# EAGLE design ECE477_schematic (EAGLE 8.6.0)
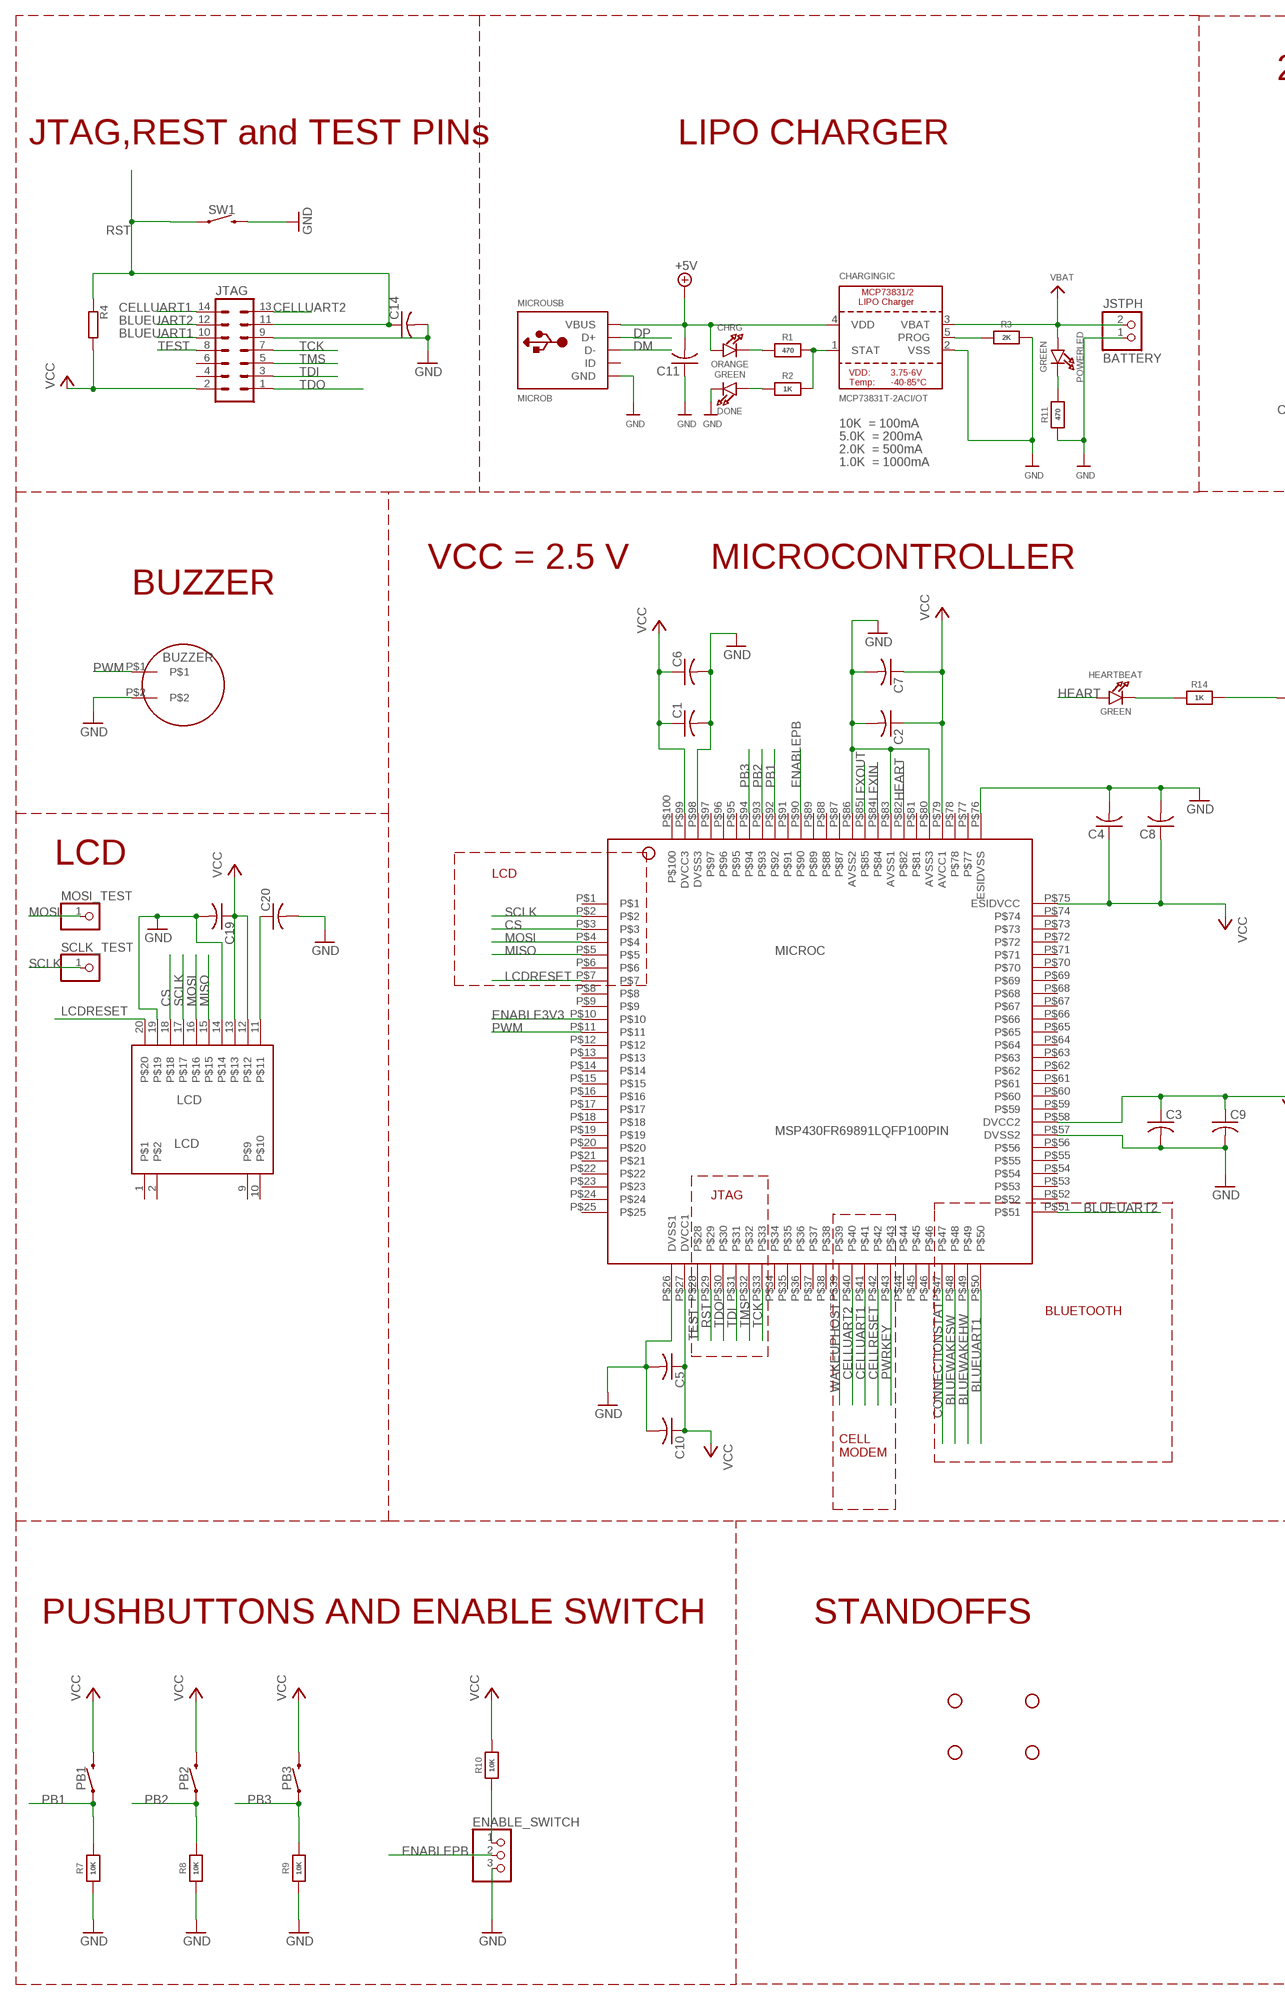
[diagram p0: schematic, sheet 1, part 1 of 2]
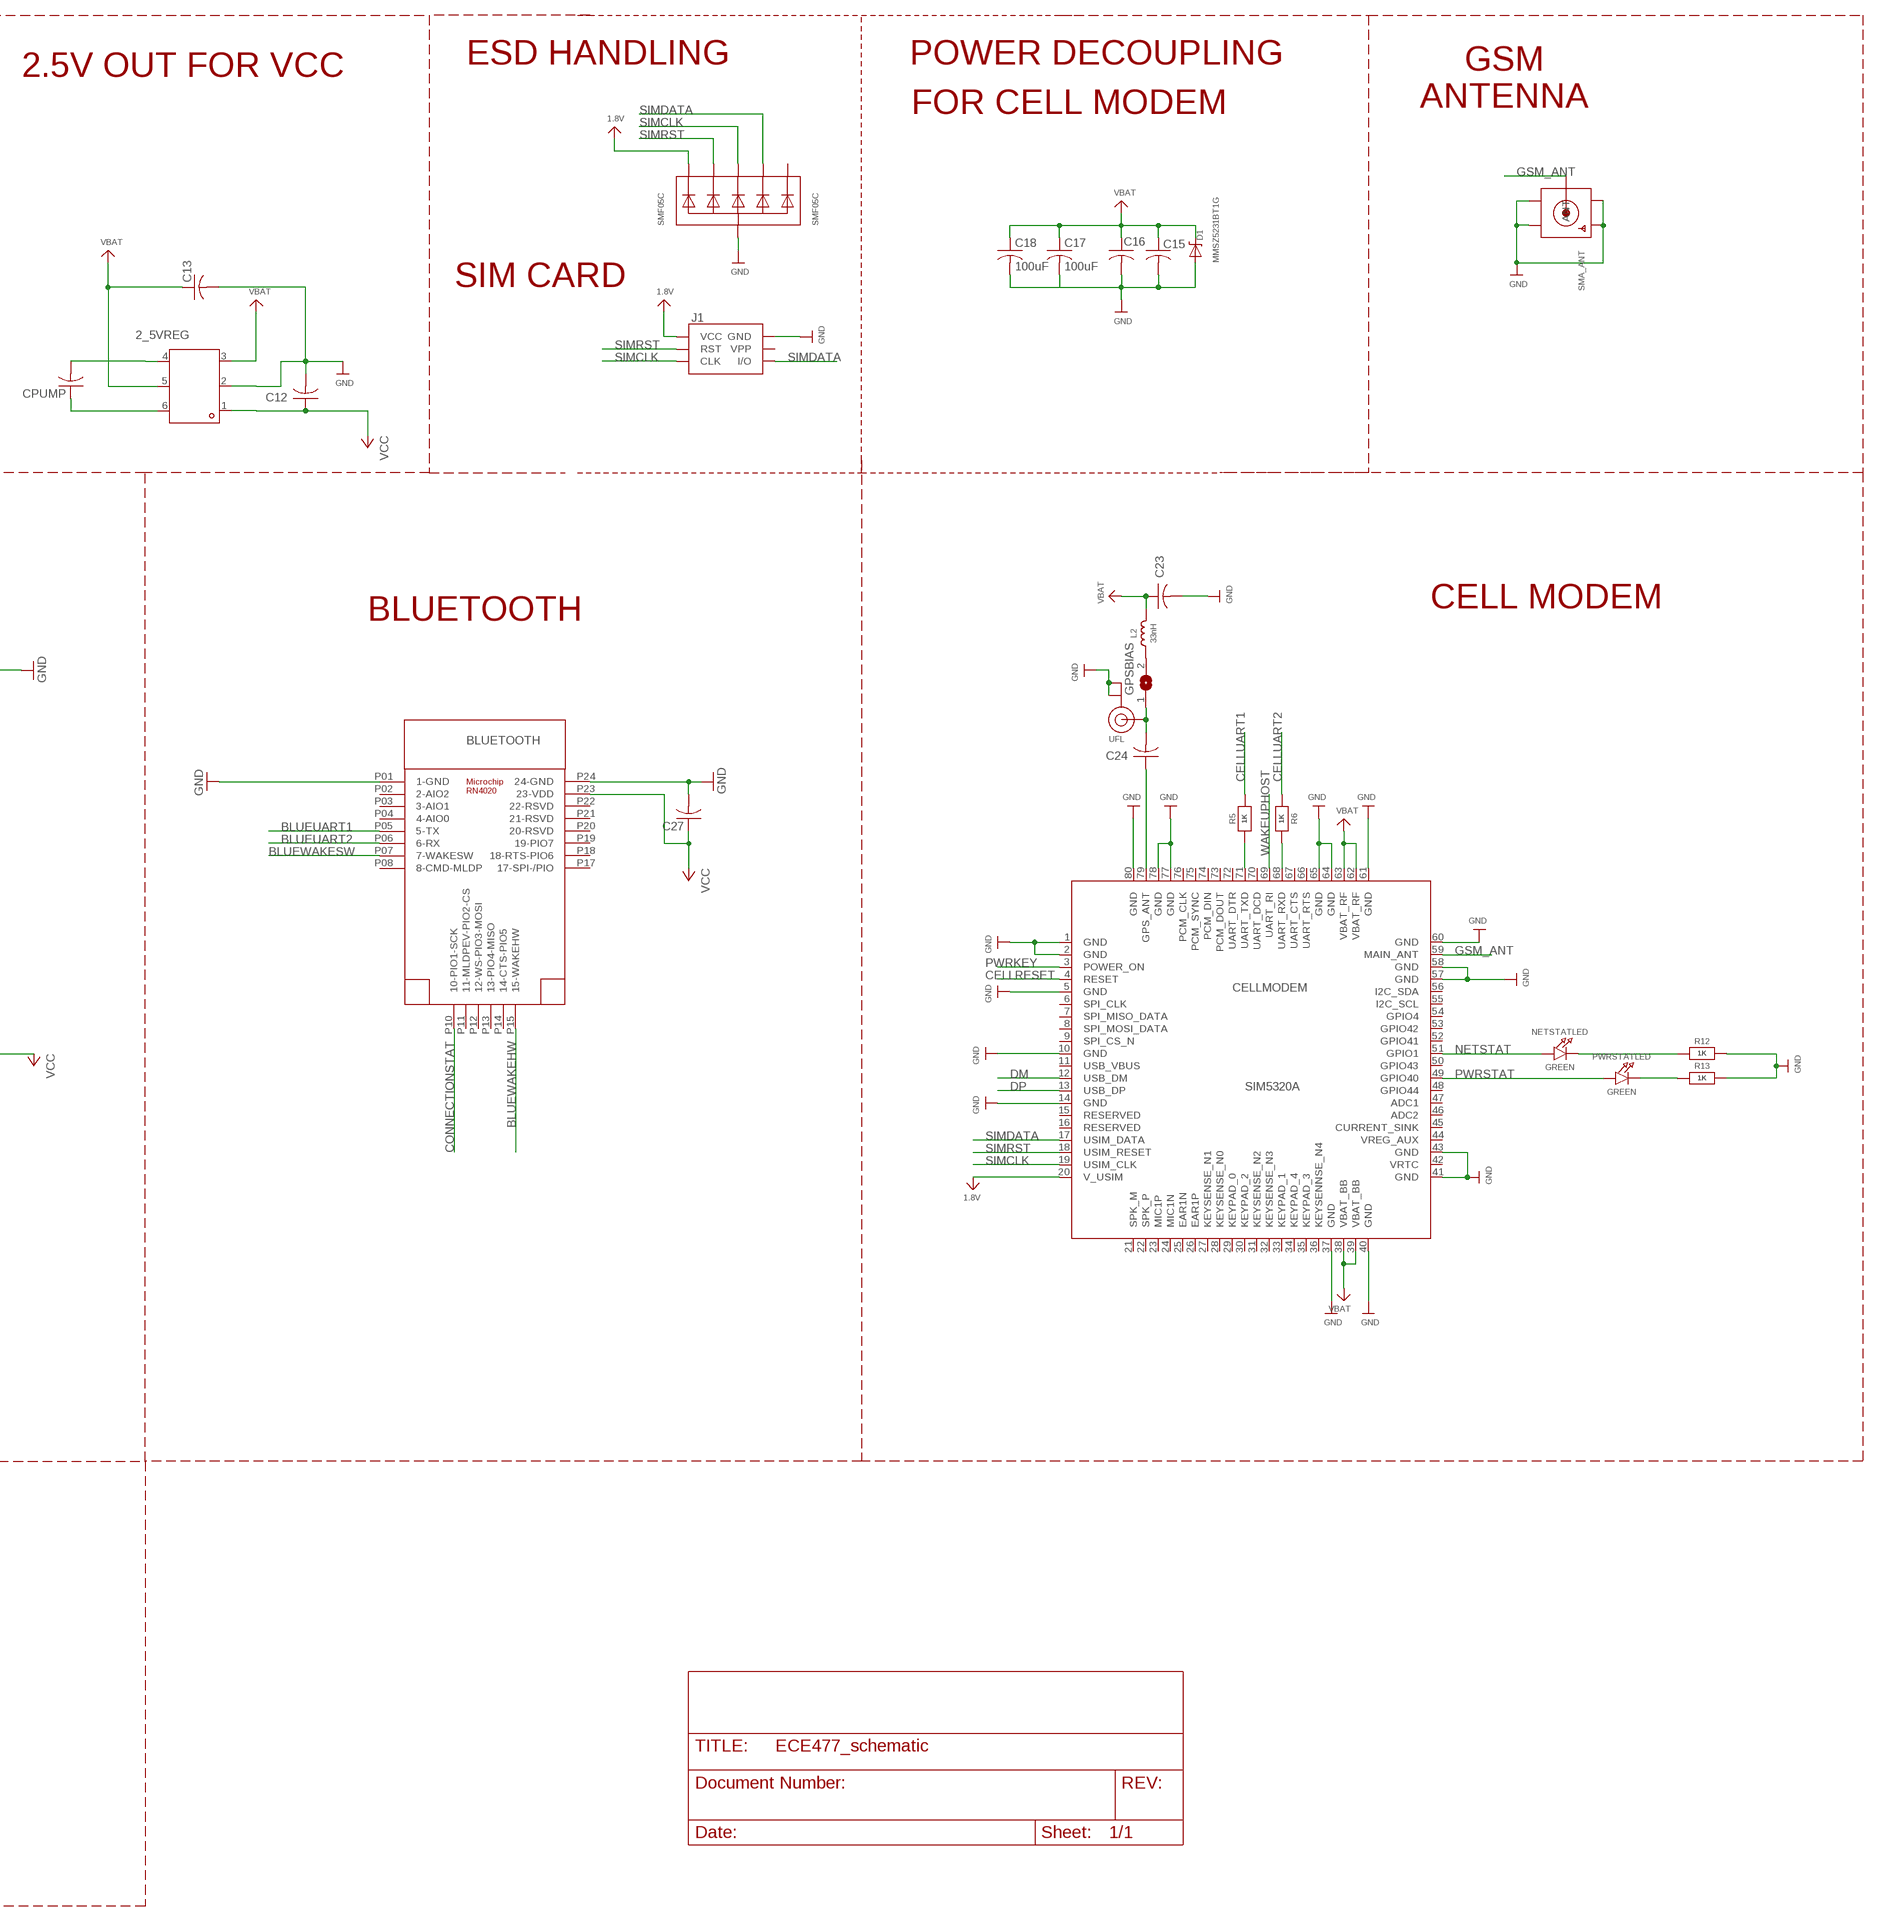
[diagram p1: schematic, sheet 1, part 2 of 2]

## Parts
2_5VREG  2_5VREG  [REG710NASOC6]
BATTERY  JSTPH  JST_2PIN  [JSTPH2]
BLUETOOTH  RN4020  [RN4020SMD]
BUZZER  BUZZER  [BUZZERTHROUGHHOLE]
C1  C-USC1206  [C1206]
C2  C-USC1206  [C1206]
C3  C-USC1206  [C1206]
C4  C-USC1206  [C1206]
C5  C-USC1206  [C1206]
C6  C-USC1206  [C1206]
C7  C-USC1206  [C1206]
C8  C-USC1206  [C1206]
C9  C-USC1206  [C1206]
C10  C-USC1206  [C1206]
C11  C-USC1206  [C1206]
C12  C-USC1206  [C1206]
C13  C-USC1206  [C1206]
C14  C-USC1206  [C1206]
C15  C-USC1206  [C1206]
C16  C-USC1206  [C1206]
C17  100uF  C-USC1210  [C1210]
C18  100uF  C-USC1210  [C1210]
C19  C-USC1206  [C1206]
C20  C-USC1206  [C1206]
C23  C-USC1206  [C1206]
C24  C-USC1206  [C1206]
C27  C-USC1206  [C1206]
CELLMODEM  SIM5320A  SIM5320  [MICROBUILDER_SIM5320]
CHARGINGIC  MCP73831T-2ACI/OT  MCP73831/2  [SOT23-5]
CHRG  ORANGE  LED0805_NOOUTLINE  [CHIPLED_0805_NOOUTLINE]
CPUMP  C-USC1206  [C1206]
D1  MMSZ5231BT1G  DIODE-ZENERSOD123  [SOD-123]
DONE  GREEN  LED0805_NOOUTLINE  [CHIPLED_0805_NOOUTLINE]
ENABLE_SWITCH  PINHD-1X3  [1X03]
GPSBIAS  SOLDERJUMPER  [SOLDERJUMPER_ARROW_NOPASTE]
H1  STAND-OFF  [STAND-OFF]
H2  STAND-OFF  [STAND-OFF]
H3  STAND-OFF  [STAND-OFF]
H4  STAND-OFF  [STAND-OFF]
HEARTBEAT  GREEN  LED0805_NOOUTLINE  [CHIPLED_0805_NOOUTLINE]
J1  SIMHOLDERSIM  [SIMHOLDER]
JTAG  CON-ML_ML14  [CON-ML_ML14]
L2  33nH  INDUCTOR_0805MP  [_0805MP]
LCD  LCD  [LCDTHROUGHHOLE]
MICROC  MSP430FR69891LQFP100PIN  [MSP430FR69891]
MICROUSB  MICROB  [ZX62DB5PA8(30)]
MOSI_TEST  PINHD-1X1  [1X01]
NETSTATLED  GREEN  LED0805_NOOUTLINE  [CHIPLED_0805_NOOUTLINE]
PB1  MOMENTARY-SWITCH-SPST-PTH-6.0MM  [TACTILE_SWITCH_PTH_6.0MM]
PB2  MOMENTARY-SWITCH-SPST-PTH-6.0MM  [TACTILE_SWITCH_PTH_6.0MM]
PB3  MOMENTARY-SWITCH-SPST-PTH-6.0MM  [TACTILE_SWITCH_PTH_6.0MM]
POWERLED  GREEN  LED0805_NOOUTLINE  [CHIPLED_0805_NOOUTLINE]
PWRSTATLED  GREEN  LED0805_NOOUTLINE  [CHIPLED_0805_NOOUTLINE]
R1  470  RESISTOR0805_NOOUTLINE  [0805-NO]
R2  1K  RESISTOR0805_NOOUTLINE  [0805-NO]
R3  2K  RESISTOR0805_NOOUTLINE  [0805-NO]
R4  SMD_R_0805  [SMD_0805]
R5  1K  RESISTOR0805_NOOUTLINE  [0805-NO]
R6  1K  RESISTOR0805_NOOUTLINE  [0805-NO]
R7  10K  RESISTOR0805_NOOUTLINE  [0805-NO]
R8  10K  RESISTOR0805_NOOUTLINE  [0805-NO]
R9  10K  RESISTOR0805_NOOUTLINE  [0805-NO]
R10  10K  RESISTOR0805_NOOUTLINE  [0805-NO]
R11  470  RESISTOR0805_NOOUTLINE  [0805-NO]
R12  1K  RESISTOR0805_NOOUTLINE  [0805-NO]
R13  1K  RESISTOR0805_NOOUTLINE  [0805-NO]
R14  1K  RESISTOR0805_NOOUTLINE  [0805-NO]
SCLK_TEST  PINHD-1X1  [1X01]
SMA_ANT  MICROBUILDER_SMACONNECTOR_EDGE  [MICROBUILDER_SMA_EDGELAUNCH]
SMF05C  SMF05C  TVSARRAY_5LANE  [SOT363]
SW1  MOMENTARY-SWITCH-SPST-PTH-6.0MM  [TACTILE_SWITCH_PTH_6.0MM]
UFL  MICROBUILDER_ANTENNA_U.FL  [MICROBUILDER_U.FL]

## Nets
1.8V: CELLMODEM.20(V_USIM) J1.C1(VCC) SMF05C.1(C1)
+5V: C11.2 CHARGINGIC.4(VDD) CHRG.A MICROUSB.+5V(VBUS)
BLUEUART1: BLUETOOTH.P05(5-TX) JTAG.10 MICROC.P$50
BLUEUART2: BLUETOOTH.P06(6-RX) JTAG.12 MICROC.P$51
BLUEWAKEHW: BLUETOOTH.P15(15-WAKEHW) MICROC.P$49
BLUEWAKESW: BLUETOOTH.P07(7-WAKESW) MICROC.P$48
CELLRESET: CELLMODEM.4(RESET) MICROC.P$42
CELLUART1: JTAG.14 MICROC.P$41 R5.2
CELLUART2: JTAG.13 MICROC.P$40 R6.2
CONNECTIONSTAT: BLUETOOTH.P10(10-PIO1-SCK) MICROC.P$47
CS: LCD.18 MICROC.P$3
DM: CELLMODEM.12(USB_DM) MICROUSB.D-
DP: CELLMODEM.13(USB_DP) MICROUSB.D+
ENABLE3V3: MICROC.P$10
ENABLEPB: ENABLE_SWITCH.2 MICROC.P$90
GND: 2_5VREG.2 BATTERY.1 BLUETOOTH.P01(1-GND) BLUETOOTH.P24(24-GND) BUZZER.P$2 C1.2 C2.2 C3.2 C4.2 C5.2 C6.2 C7.2 C8.2 C9.2 C10.2 C11.1 C12.2 C13.2 C14.2 C15.2 C16.2 C17.2 C18.2 C19.2 C20.2 C23.2 C27.2 CELLMODEM.1(GND) CELLMODEM.2(GND) CELLMODEM.5(GND) CELLMODEM.10(GND) CELLMODEM.14(GND) CELLMODEM.37(GND) CELLMODEM.40(GND) CELLMODEM.41(GND) CELLMODEM.43(GND) CELLMODEM.57(GND) CELLMODEM.58(GND) CELLMODEM.60(GND) CELLMODEM.61(GND) CELLMODEM.64(GND) CELLMODEM.65(GND) CELLMODEM.77(GND) CELLMODEM.78(GND) CELLMODEM.80(GND) CHARGINGIC.2(VSS) D1.A DONE.C ENABLE_SWITCH.3 J1.C5(GND) JTAG.9 LCD.14 LCD.19 MICROC.P$26(DVSS1) MICROC.P$57(DVSS2) MICROC.P$76(ESIDVSS) MICROC.P$80(AVSS3) MICROC.P$83(AVSS1) MICROC.P$86(AVSS2) MICROC.P$98(DVSS3) MICROUSB.GND R3.2 R7.1 R8.1 R9.1 R11.1 R12.2 R13.2 R14.2 SMA_ANT.GND@1(GND4) SMA_ANT.GND@2(GND3) SMA_ANT.GND@3(GND2) SMA_ANT.GND@4(GND1) SMF05C.2(A) SW1.3 UFL.1(GND) UFL.2(GND)
GSM_ANT: CELLMODEM.59(MAIN_ANT) SMA_ANT.P(ANT)
HEART: HEARTBEAT.A MICROC.P$82
LCDRESET: LCD.20 MICROC.P$7
LFXIN: MICROC.P$84
LFXOUT: MICROC.P$85
MISO: LCD.15 MICROC.P$5
MOSI: LCD.16 MICROC.P$4 MOSI_TEST.1
N$1: CHRG.C R1.1
N$2: CHARGINGIC.1(STAT) R1.2 R2.2
N$3: C20.1 LCD.11
N$4: 2_5VREG.4 CPUMP.2
N$5: CHARGINGIC.5(PROG) R3.1
N$6: DONE.A R2.1
N$7: 2_5VREG.6 CPUMP.1
N$8: C24.1 CELLMODEM.79(GPS_ANT)
N$9: C24.2 GPSBIAS.1 UFL.3(SIGNAL)
N$10: CELLMODEM.71(UART_TXD) R5.1
N$11: CELLMODEM.68(UART_RXD) R6.1
N$12: POWERLED.C R11.2
N$13: NETSTATLED.C R12.1
N$14: ENABLE_SWITCH.1 R10.1
N$15: PWRSTATLED.C R13.1
N$31: GPSBIAS.2 L2.1
N$84: HEARTBEAT.C R14.1
NETSTAT: CELLMODEM.51(GPIO1) NETSTATLED.A
PB1: MICROC.P$92 PB1.1 R7.2
PB2: MICROC.P$93 PB2.1 R8.2
PB3: MICROC.P$94 PB3.1 R9.2
PWM: BUZZER.P$1 MICROC.P$11
PWRKEY: CELLMODEM.3(POWER_ON) MICROC.P$43
PWRSTAT: CELLMODEM.49(GPIO40) PWRSTATLED.A
RST: C14.1 JTAG.11 MICROC.P$29 R4.1 SW1.1
SCLK: LCD.17 MICROC.P$2 SCLK_TEST.1
SIMCLK: CELLMODEM.19(USIM_CLK) J1.C3(CLK) SMF05C.4(C3)
SIMDATA: CELLMODEM.17(USIM_DATA) J1.C7(I/O) SMF05C.5(C4)
SIMRST: CELLMODEM.18(USIM_RESET) J1.C2(RST) SMF05C.3(C2)
TCK: JTAG.7 MICROC.P$33
TDI: JTAG.3 MICROC.P$31
TDO: JTAG.1 MICROC.P$30
TEST: JTAG.8 MICROC.P$28
TMS: JTAG.5 MICROC.P$32
VBAT: 2_5VREG.3 2_5VREG.5 BATTERY.2 C13.1 C15.1 C16.1 C17.1 C18.1 C23.1 CELLMODEM.38(VBAT_BB) CELLMODEM.39(VBAT_BB) CELLMODEM.62(VBAT_RF) CELLMODEM.63(VBAT_RF) CHARGINGIC.3(VBAT) D1.C L2.2 POWERLED.A
VCC: 2_5VREG.1 BLUETOOTH.P23(23-VDD) C1.1 C2.1 C3.1 C4.1 C5.1 C6.1 C7.1 C8.1 C9.1 C10.1 C12.1 C19.1 C27.1 JTAG.2 LCD.12 LCD.13 MICROC.P$27(DVCC1) MICROC.P$58(DVCC2) MICROC.P$75(ESIDVCC) MICROC.P$79(AVCC1) MICROC.P$99(DVCC3) PB1.3 PB2.3 PB3.3 R4.2 R10.2
WAKEUPHOST: CELLMODEM.69(UART_RI) MICROC.P$39
Unconnected: BLUETOOTH.P02(2-AIO2) BLUETOOTH.P03(3-AIO1) BLUETOOTH.P04(4-AIO0) BLUETOOTH.P08(8-CMD-MLDP) BLUETOOTH.P11(11-MLDPEV-PIO2-CS) BLUETOOTH.P12(12-WS-PIO3-MOSI) BLUETOOTH.P13(13-PIO4-MISO) BLUETOOTH.P14(14-CTS-PIO5) BLUETOOTH.P17(17-SPI-/PIO) BLUETOOTH.P18(18-RTS-PIO6) BLUETOOTH.P19(19-PIO7) BLUETOOTH.P20(20-RSVD) BLUETOOTH.P21(21-RSVD) BLUETOOTH.P22(22-RSVD) CELLMODEM.6(SPI_CLK) CELLMODEM.7(SPI_MISO_DATA) CELLMODEM.8(SPI_MOSI_DATA) CELLMODEM.9(SPI_CS_N) CELLMODEM.11(USB_VBUS) CELLMODEM.15(RESERVED) CELLMODEM.16(RESERVED) CELLMODEM.21(SPK_M) CELLMODEM.22(SPK_P) CELLMODEM.23(MIC1P) CELLMODEM.24(MIC1N) CELLMODEM.25(EAR1N) CELLMODEM.26(EAR1P) CELLMODEM.27(KEYSENSE_N1) CELLMODEM.28(KEYSENSE_N0) CELLMODEM.29(KEYPAD_0) CELLMODEM.30(KEYPAD_2) CELLMODEM.31(KEYSENSE_N2) CELLMODEM.32(KEYSENSE_N3) CELLMODEM.33(KEYPAD_1) CELLMODEM.34(KEYPAD_4) CELLMODEM.35(KEYPAD_3) CELLMODEM.36(KEYSENNSE_N4) CELLMODEM.42(VRTC) CELLMODEM.44(VREG_AUX) CELLMODEM.45(CURRENT_SINK) CELLMODEM.46(ADC2) CELLMODEM.47(ADC1) CELLMODEM.48(GPIO44) CELLMODEM.50(GPIO43) CELLMODEM.52(GPIO41) CELLMODEM.53(GPIO42) CELLMODEM.54(GPIO4) CELLMODEM.55(I2C_SCL) CELLMODEM.56(I2C_SDA) CELLMODEM.66(UART_RTS) CELLMODEM.67(UART_CTS) CELLMODEM.70(UART_DCD) CELLMODEM.72(UART_DTR) CELLMODEM.73(PCM_DOUT) CELLMODEM.74(PCM_DIN) CELLMODEM.75(PCM_SYNC) CELLMODEM.76(PCM_CLK) J1.C6(VPP) JTAG.4 JTAG.6 LCD.1 LCD.2 LCD.9 LCD.10 MICROC.P$1 MICROC.P$6 MICROC.P$8 MICROC.P$9 MICROC.P$12 MICROC.P$13 MICROC.P$14 MICROC.P$15 MICROC.P$16 MICROC.P$17 MICROC.P$18 MICROC.P$19 MICROC.P$20 MICROC.P$21 MICROC.P$22 MICROC.P$23 MICROC.P$24 MICROC.P$25 MICROC.P$34 MICROC.P$35 MICROC.P$36 MICROC.P$37 MICROC.P$38 MICROC.P$44 MICROC.P$45 MICROC.P$46 MICROC.P$52 MICROC.P$53 MICROC.P$54 MICROC.P$55 MICROC.P$56 MICROC.P$59 MICROC.P$60 MICROC.P$61 MICROC.P$62 MICROC.P$63 MICROC.P$64 MICROC.P$65 MICROC.P$66 MICROC.P$67 MICROC.P$68 MICROC.P$69 MICROC.P$70 MICROC.P$71 MICROC.P$72 MICROC.P$73 MICROC.P$74 MICROC.P$77 MICROC.P$78 MICROC.P$81 MICROC.P$87 MICROC.P$88 MICROC.P$89 MICROC.P$91 MICROC.P$95 MICROC.P$96 MICROC.P$97 MICROC.P$100 MICROUSB.ID SMF05C.6(C5)

## Notes on the sheet
- POWER DECOUPLING
- ESD HANDLING
- 2.5V OUT FOR VCC
- GSM
  ANTENNA
- FOR CELL MODEM
- LIPO CHARGER
- JTAG,REST and TEST PINs
- SIM CARD
- 10K  = 100mA
- 5.0K  = 200mA
- 2.0K  = 500mA
- 1.0K  = 1000mA
- VCC = 2.5 V | MICROCONTROLLER
- BUZZER
- CELL MODEM
- BLUETOOTH
- LCD
- LCD
- JTAG
- BLUETOOTH
- CELL
  MODEM
- PUSHBUTTONS AND ENABLE SWITCH | STANDOFFS

## Library data of the parts
2_5VREG = ECE477_parts_library:2_5VREG
BATTERY = microbuilder:JST_2PIN: JST 2-Pin Right-Angle Connector PH-Series - 4UConnector: 17311 SH-Series - 4UConnector: 07278
BLUETOOTH = microchip_bluetooth_v101:RN4020
BUZZER = ECE477_parts_library:BUZZER
C1-C16 C19 C20 C23 C24 C27 CPUMP = rcl:C-US: CAPACITOR, American symbol; SPICEPREFIX: C
C17 C18 = rcl:C-US: CAPACITOR, American symbol
CELLMODEM = ECE477_parts_library:SIM5320
CHARGINGIC = microbuilder:MCP73831/2: MCP73831/2 LIPO Charger VDD: 3.75 - 6V Temp -40 - 85°C Programmable Charge Rate: 15-500mA NOTE: STAT is a tri-state logic output on the MCP73831 and an open-drain output on the MCP73832. SOT23-5 with 4.2V output and tri-state logic on STAT = MCP73831T-2ACI/OT
CHRG DONE HEARTBEAT NETSTATLED POWERLED PWRSTATLED = microbuilder:LED: LED 0603 - 0603 Surface Mount Package 2mA: Green LED - Low Power (3.9mcd, 2ma, 1.7Vf) - Digikey: 475-2709-2-ND Orange LED - Low Power (9.8mcd, 2ma, 1.8Vf) - Digikey: 475-1194-2-ND Red LED - Low Power (5mcd, 2ma, 1.8Vf) - Digikey: 475-1195-2-ND Yellow LED - Low Power (7mcd, 2ma, 1.8Vf) - Digikey: 475-1196-2-ND 5mA: Blue LED - Low Power (17mcd, 5ma, 2.9Vf) - Digikey: LNJ937W8CRACT-ND 0805 - 0805 Surface Mount Package 2mA: Red LED (8.8mcd, 2mA, 1.8Vf, Clear) - Low Power [Digikey: 475-2510-1-ND] Green LED (5mcd, 2mA, 1.8Vf, Clear) - Low Power [Digikey: 475-2730-1-ND] Yellow LED (11.3mcd, 2mA, 1.8Vf, Clear) - Low Power [Digikey: 475-2555-1-ND] 20mA: Red LED (104mcd, 20mA, Diffused) - LS R976 [Digikey: 475-1278-6-ND] Red LED (12mcd, 20mA, 2.0Vf, Clear) - APT2012EC [Digikey: 754-1128-1-ND] Green LED (15mcd, 20mA, 2.2Vf, Clear) - APT2012GC [Digikey: 754-1131-1-ND] Orange LED (160mcd, 20mA, 2.1Vf, Clear) - APT2012SECK [Digikey: 754-1130-1-ND] 1206 - 1206 Surface Mount Package Green LED (26mcd, 20mA, Diffused) - LG N971 [Digikey: 475-1407-6-ND] Red LED (15mcd, 20mA, Diffused) - LH N974 [Digikey: 475-1416-6-ND] Cree - Cree High-Power Surface Mount LEDs XPEBWT-L1-0000-00D50 - White 111lm 350mA 2.9Vf 6200K 110° XTEAWT-00-0000-00000LEE3 - White 114lm 350mA 2.85Vf 5000K 115° Everlight - Everlight 45-21 Series Surface Mount LEDs 45-21/QK2C-B2832AC2CB2/2T - Warm White 2000mcd 20mA 3.25Vf 3050K 120° 45-21/LK2C-B38452C4CB2/2T - Nuetral White 2000mcd 20mA 3.25Vf 4150K 120° 45-21/LK2C-B50634C6CB2/2T - Cold White 2200mcd 20mA 3.25Vf 5650K 120° PLCC2 Reverse Mount LS T77K-J1L2-1-0-2-R18-Z - Red 11.25mcd 2mA 1.8Vf 630nm 120° LO T77K-L1M2-24-Z - Orange 19.6mcd 2mA 1.8Vf 606nm 120° LY T77K-K2M1-26-Z - Yellow 15.7mcd 2mA 1.8Vf 587nm 120°
D1 = microbuilder:DIODE-ZENER: Zener Diode SMA: 30V 1W Zener Diode, 1.2Vf - Digikey: SMAZ30-FDICT-ND
ENABLE_SWITCH = pinhead:PINHD-1X3: PIN HEADER
GPSBIAS = microbuilder:SOLDERJUMPER: SMD Solder JUMPER Solder the two pads together to create a connection, or remove the solder to break it. REFLOW - Use this footprint for solder paste and reflow ovens. WAVE - Use this footprint for hand-soldering (larger pads). CLOSED - Has a trace between the two pads to ensure it is closed by default. The trace needs to be cut to disable the jumper, and can be closed again by creating a solder bridge between the two pads.; BOM: EXCLUDE
H1-H4 = SparkFun-Hardware:STAND-OFF: Stand Off Drill holes for mechanically mounting via screws, standoffs, etc. Note: Use the keepout ring to avoid running the screw head into surrounding components. Variant Overviews STAND-OFF - Mechanical footprint for a #4 phillips button head screw. STAND-OFF-TIGHT - Mechanical footprint for a #4 phillips button head screw, Example SparkFun Products Screw - Phillips Head (1/4", 4-40, 10 pack) <https://www.sparkfun.com/products/10453> (PRT-10453) Screw - Phillips Head (1/2", 4-40, 10 pack) <https://www.sparkfun.com/products/10452> (PRT-10452) Screw - Phillips Head (3/4", 4-40, 10 pack) <https://www.sparkfun.com/products/10451> (PRT-10451) Screw - Phillips Head (1", 4-40, 10 pack) <https://www.sparkfun.com/products/10450> (PRT-10450)
J1 = SparkFun-Connectors:SIMHOLDER: SIM Cellular Card Socket SMT 6 pin standard connection. SparkFun Products: SIM Socket <https://www.sparkfun.com/products/548> SparkFun Cellular Shield - MG2639 <https://www.sparkfun.com/products/13120> SparkFun SIM Card Socket Breakout <https://www.sparkfun.com/products/573>; PROD_ID: CONN-08536; SF_ID: PRT-00548
JTAG = MSP-TS430PZ100D_v1.2:CON-ML_ML14: HARTING
L2 = microbuilder:INDUCTOR: Inductors 0603: 10nH Ceramic Inductor - microwire antenna/RF (Digikey: 712-1434-2-ND) 0805: 560nH Ceramic Inductor - RF (Digikey: 553-1047-1-ND) 270nH Ceramic Inductor - Q = 40@250MHz, +-5%, 1 Ohm DC Resistance (Digikey: 535-10506-2-ND) 1007 (2518 Metric) SMT: 10µH 10% 250mOhm 820mA 1007 Inductor (Digikey: 587-2189-1-ND) 22µH 10% 500mOhm 580mA 1007 Inductor (Digikey: 587-2190-1-ND) 47µH 10% 950mOhm 420mA 1007 Inductor (Digikey: 587-2191-1-ND) 47µH 5% 100mOhm 1A 1008 Inductor (Digikey: 732-1816-1-ND) 5.0x5.0mm (Taiyo Yuden NR5040 Series) 6.8µH 20% 2.3A 64mOhm Inductor (Digikey: 587-2374-2-ND) 5.0x5.0mm (TDK VLC5045 Series) 4.7µH 20% 3.3A 34mOhm Inductor (Digikey: 445-6526-1-ND) 6.8µH 20% 2.7A 46mOhm Inductor (Digikey: 445-6527-1-ND) 6.0x6.0mm (TDK VLC6045 Series) 4.7µH 20% 3.8A 27mOhm Inductor (Digikey: 445-6538-2-ND) 6.8µH 20% 3A 41mOhm Inductor (Digikey: 445-6540-1-ND) 6.2µH 30% 2.2A 45mOhm Inductor (Digikey: SRR5028-6R2YCT-ND) - Not TDK VLC6045 but footprint should match 6.0x6.0mm (TDK SLF6045 Series) 6.8uH 30% 2A 33mOhm Inductor (Digikey: 445-4572-1-ND, Mouser: 810-SLF645T6R8N2R0PF) 6.0x6.0mm (Sumida CDRH5D28 Series) 6.2uH 30% 1.8A 45mOhm Inductor (Digikey: 308-1542-1-ND) Taiyo Yuden NR3015T2R2M - 2.2uH 20% 1.5A (Digikey: 587-1648-2-ND, Mouser: 963-NR3015T2R2M) - Used with TI TPS62172 CoilCraft RFID Transponder Coil - MA5532-AE (For use with AS3935 Lightning Sensor) Vishay IHLP 1.0uH Molded Inductor - 24mOhm DCR, 5A, +/-20%, -55°C-125°C (Digikey: 541-1319-1-ND)
LCD = ECE477_parts_library:LCD
MICROC = ECE477_parts_library:MSP430FR69891
MICROUSB = ECE477_parts_library:MICROB
MOSI_TEST SCLK_TEST = pinhead:PINHD-1X1: PIN HEADER
PB1-PB3 SW1 = SparkFun-Switches:MOMENTARY-SWITCH-SPST: Momentary Switch (Pushbutton) - SPST Normally-open (NO) SPST momentary switches (buttons, pushbuttons). Variants PTH-12MM - 12mm square, through-hole Momentary Pushbutton Switch - 12mm Square <https://www.sparkfun.com/products/9190> (COM-09190) PTH-6.0MM, PTH-6.0MM-KIT - 6.0mm square, through-hole Mini Pushbutton Switch <https://www.sparkfun.com/products/97> (COM-00097) KIT package intended for soldering kit's - only one side of pads' copper is exposed. PTH-RIGHT-ANGLE-KIT - Right-angle, through-hole Right Angle Tactile Button <https://www.sparkfun.com/products/10791> - Used on SparkFun BigTime Watch Kit <https://www.sparkfun.com/products/11734> SMD-12MM - 12mm square, surface-mount Tactile Button - SMD (12mm) <https://www.sparkfun.com/products/12993> (COM-12993) Used on SparkFun PicoBoard <https://www.sparkfun.com/products/11888> SMD-4.5MM - 4.5mm Square Trackball Switch Used on SparkFun Blackberry Trackballer Breakout <https://www.sparkfun.com/products/13169> SMD-4.6MMX2.8MM - 4.60mm x 2.80mm, surface mount Used on SparkFun SAMD21 Mini Breakout <https://www.sparkfun.com/products/13664> SMD-5.2MM, SMD-5.2-REDUNDANT - 5.2mm square, surface-mount Mini Pushbutton Switch - SMD <https://www.sparkfun.com/products/8720> (COM-08720) Used on Arduino Pro Mini <https://www.sparkfun.com/products/11114> REDUNDANT package connects both switch circuits together SMD-6.0X3.5MM - 6.0 x 3.5mm, surface mount Momentary Reset Switch SMD <https://www.sparkfun.com/products/8229> (COM-08229) SMD-6.2MM-TALL - 6.2mm square, surface mount Tactile Button - SMD (6mm) <https://www.sparkfun.com/products/12992> Used on SparkFun Digital Sandbox <https://www.sparkfun.com/products/12651> SMD-RIGHT-ANGLE - Right-angle, surface mount Used on SparkFun Block for Intel® Edison - Arduino <https://www.sparkfun.com/products/13036>; PROD_ID: SWCH-08441; SF_SKU: COM-00097
R1-R3 R5-R14 = microbuilder:RESISTOR: Resistors For new designs, use the packages preceded by an '_' character since they are more reliable: The following footprints should be used on most boards: _0402 - Standard footprint for regular board layouts _0603 - Standard footprint for regular board layouts _0805 - Standard footprint for regular board layouts _1206 - Standard footprint for regular board layouts For extremely tight-pitch boards where space is at a premium, the following 'micro-pitch' footprints can be used (smaller pads, no silkscreen outline, etc.): _0402MP - Micro-pitch footprint for very dense/compact boards _0603MP - Micro-pitch footprint for very dense/compact boards _0805MP - Micro-pitch footprint for very dense/compact boards _1206MP - Micro-pitch footprint for very dense/compact boards
R4 = MSP-TS430PZ100D_v1.2:SMD_R_0805
SMA_ANT = Adafruit FONA SIM5320 3G Breakout:MICROBUILDER_SMACONNECTOR: SMA Connector 90¡ã DIP SMA Connector, 50 Ohm (4UConnector: 07259)
SMF05C = microbuilder:TVSARRAY_5LANE: Voltage Transient Suppressor Array SOT363 SMF05C - 100W 5V: Digikey - SMF05CT1GOSCT-ND
UFL = Adafruit FONA SIM5320 3G Breakout:MICROBUILDER_ANTENNA_U.FL: U.FL Antenna Connector

## Board
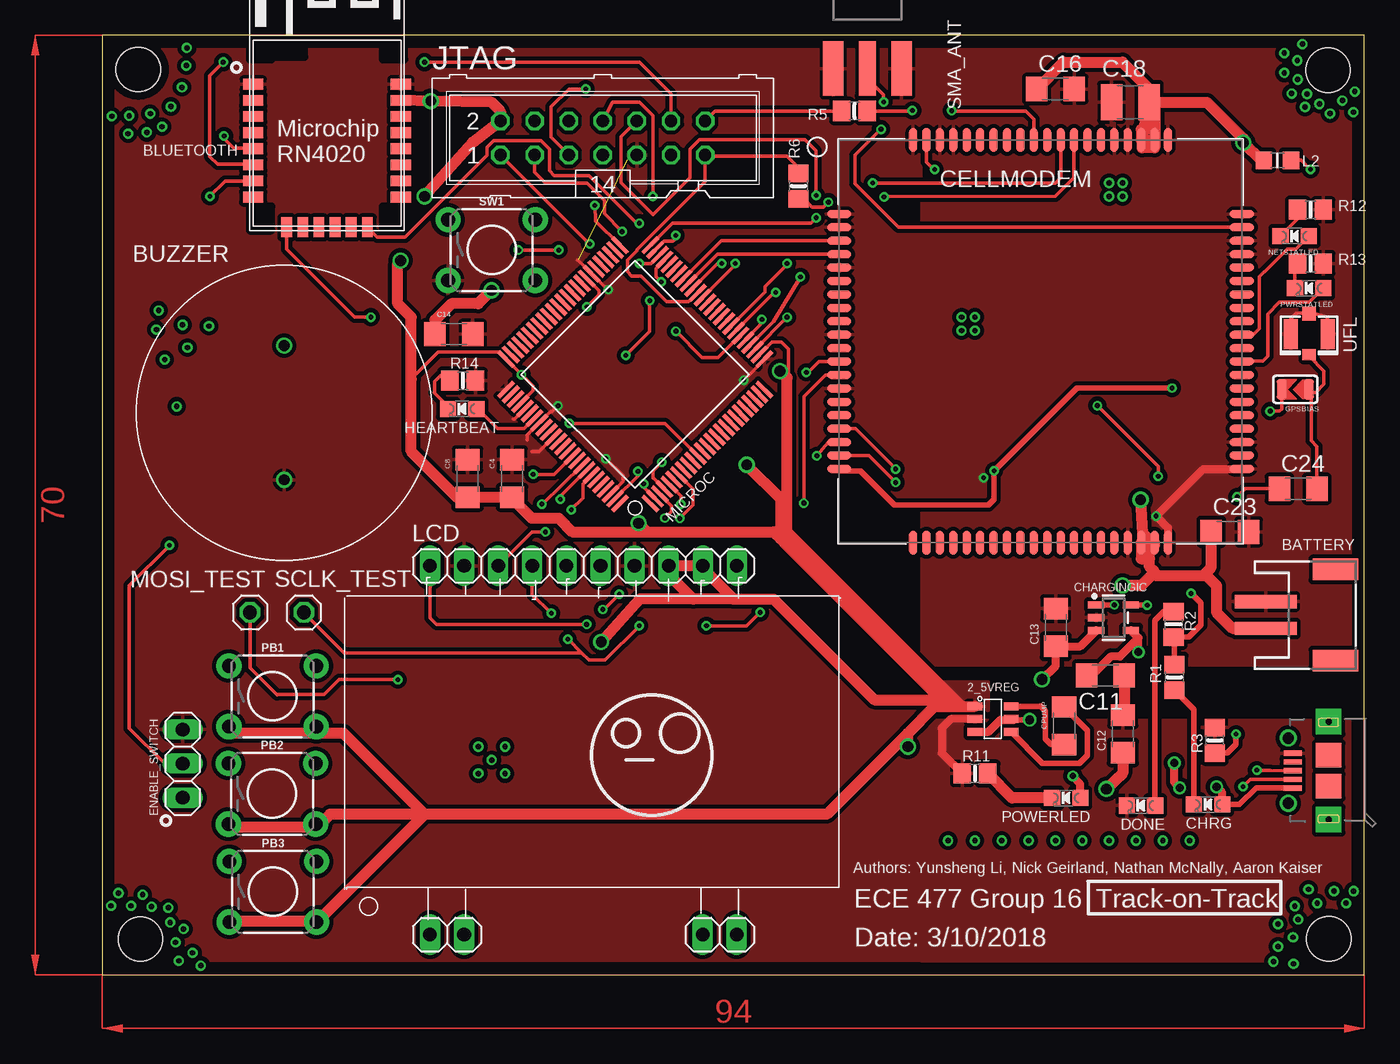
[diagram p2: board, top side]
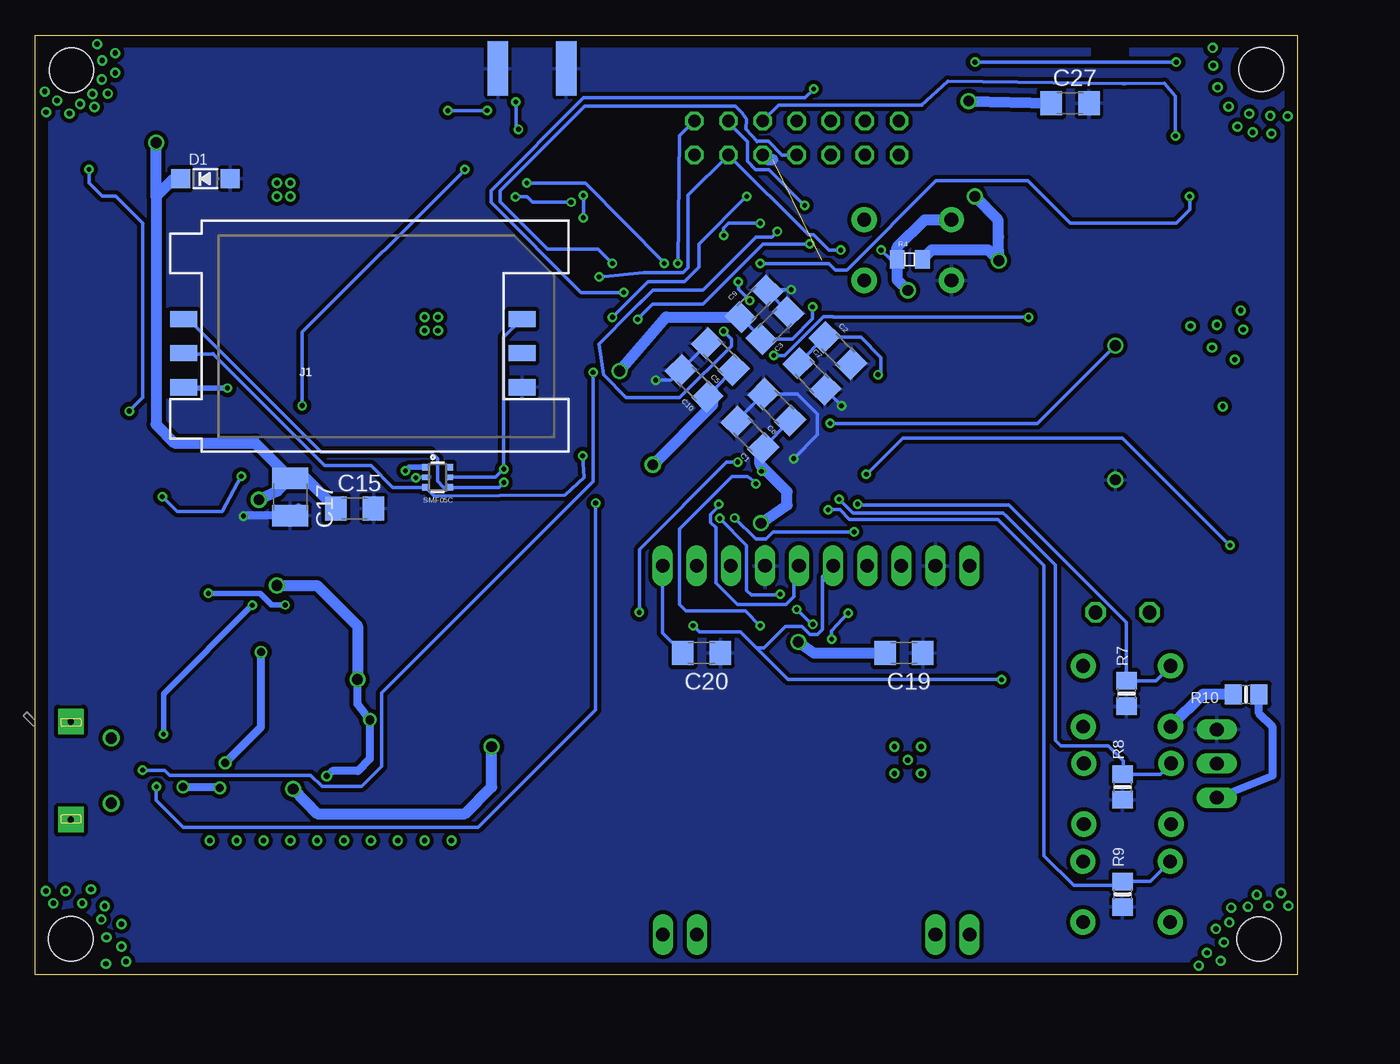
[diagram p3: board, bottom side, seen from below]

Size 94 x 70 mm. Coordinates in mm from the lower left corner, seen from the top.
Outline: 0,0 94,0 94,70 0,70 0,0
Copper layers (1*16): Top 0.0356mm / dielectric 1.5011mm / Bottom 0.0356mm
Design rules "ECE_Senior_Design": minimum track width 8mil, minimum drill 13mil, track to track 8mil, track to pad 8mil, pad to pad 6mil, via to via 8mil, smd to smd 6mil, copper to edge 15mil, drill to drill 8mil, minimum pad ring 7mil, minimum via ring 7mil, stop-mask expansion 3mil, vias tented up to drill 0mil, thermal gap 10mil

### Footprints (pad centres in the part's own frame; a part is rotated, then mirrored left to right if it is on the bottom)
REG710NASOC6 = smd 0.6 x 1.1: 1 0,0; 2 0.95,0; 3 1.9,0; 4 1.9,2.7; 5 0.95,2.7; 6 0,2.7
JSTPH2 = smd 1 x 4.6: 1 -1,-3.7; 2 1,-3.7 | smd 1.6 x 3.4: NC1 -3.4,1.5; NC2 3.4,1.5
RN4020SMD = smd 1.5 x 0.8: P01 0.25,10.9; P02 0.25,9.7; P03 0.25,8.5; P04 0.25,7.3; P05 0.25,6.1; P06 0.25,4.9; P07 0.25,3.7; P08 0.25,2.5; P17 11.25,2.5; P18 11.25,3.7; P19 11.25,4.9; P20 11.25,6.1; P21 11.25,7.3; P22 11.25,8.5; P23 11.25,9.7; P24 11.25,10.9 | smd 0.8 x 1.5: P10 2.75,0.25; P11 3.95,0.25; P12 5.15,0.25; P13 6.35,0.25; P14 7.55,0.25; P15 8.75,0.25
BUZZERTHROUGHHOLE = drill 0.8: P$1 0,5; P$2 0,-5
C1206 = smd 1.6 x 1.8: 1 -1.4,0; 2 1.4,0
C1210 = smd 1.6 x 2.7: 1 -1.4,0; 2 1.4,0
MICROBUILDER_SIM5320 = smd 1.8 x 0.6: 1 -15,9.5; 2 -15,8.5; 3 -15,7.5; 4 -15,6.5; 5 -15,5.5; 6 -15,4.5; 7 -15,3.5; 8 -15,2.5; 9 -15,1.5; 10 -15,0.5; 11 -15,-0.5; 12 -15,-1.5; 13 -15,-2.5; 14 -15,-3.5; 15 -15,-4.5; 16 -15,-5.5; 17 -15,-6.5; 18 -15,-7.5; 19 -15,-8.5; 20 -15,-9.5; 41 15,-9.5; 42 15,-8.5; 43 15,-7.5; 44 15,-6.5; 45 15,-5.5; 46 15,-4.5; 47 15,-3.5; 48 15,-2.5; 49 15,-1.5; 50 15,-0.5; 51 15,0.5; 52 15,1.5; 53 15,2.5; 54 15,3.5; 55 15,4.5; 56 15,5.5; 57 15,6.5; 58 15,7.5; 59 15,8.5; 60 15,9.5 | smd 0.6 x 1.8: 21 -9.5,-15; 22 -8.5,-15; 23 -7.5,-15; 24 -6.5,-15; 25 -5.5,-15; 26 -4.5,-15; 27 -3.5,-15; 28 -2.5,-15; 29 -1.5,-15; 30 -0.5,-15; 31 0.5,-15; 32 1.5,-15; 33 2.5,-15; 34 3.5,-15; 35 4.5,-15; 36 5.5,-15; 37 6.5,-15; 38 7.5,-15; 39 8.5,-15; 40 9.5,-15; 61 9.5,15; 62 8.5,15; 63 7.5,15; 64 6.5,15; 65 5.5,15; 66 4.5,15; 67 3.5,15; 68 2.5,15; 69 1.5,15; 70 0.5,15; 71 -0.5,15; 72 -1.5,15; 73 -2.5,15; 74 -3.5,15; 75 -4.5,15; 76 -5.5,15; 77 -6.5,15; 78 -7.5,15; 79 -8.5,15; 80 -9.5,15
SOT23-5 = smd 0.55 x 1.2: 1 -0.95,-1.3; 2 0,-1.3; 3 0.95,-1.3; 4 0.95,1.3; 5 -0.95,1.3
CHIPLED_0805_NOOUTLINE = smd 1.2 x 1.2: A 0,-1.05; C 0,1.05
SOD-123 = smd 1.4 x 1.4: A 1.85,0; C -1.85,0
1X03 = drill 1.016 long: 1 -2.54,0; 2 0,0; 3 2.54,0
SOLDERJUMPER_ARROW_NOPASTE = smd 0.762 x 1.524: 1 -1.016,0; 2 1.016,0
STAND-OFF = hole 3.302: 0,0
SIMHOLDER = smd 2 x 1.2: C1 -12.61,-3.81; C2 -12.61,-1.27; C3 -12.61,1.27; C5 12.61,-3.81; C6 12.61,-1.27; C7 12.61,1.27
CON-ML_ML14 = drill 0.914 octagon: 1 -7.62,-1.27; 2 -7.62,1.27; 3 -5.08,-1.27; 4 -5.08,1.27; 5 -2.54,-1.27; 6 -2.54,1.27; 7 0,-1.27; 8 0,1.27; 9 2.54,-1.27; 10 2.54,1.27; 11 5.08,-1.27; 12 5.08,1.27; 13 7.62,-1.27; 14 7.62,1.27
_0805MP = smd 1.2 x 1.3: 1 -1.016,0; 2 1.016,0
LCDTHROUGHHOLE = drill 1.016 long: 1 -11.432,-12.785; 2 -8.892,-12.785; 9 8.884,-12.78; 10 11.424,-12.78; 11 11.434,14.694; 12 8.894,14.694; 13 6.354,14.694; 14 3.814,14.694; 15 1.274,14.694; 16 -1.266,14.694; 17 -3.806,14.694; 18 -6.346,14.694; 19 -8.886,14.694; 20 -11.426,14.694
MSP430FR69891 = smd 1.6 x 0.3: P$1 0,0; P$2 0,-0.5; P$3 0,-1; P$4 0,-1.5; P$5 0,-2; P$6 0,-2.5; P$7 0,-3; P$8 0,-3.5; P$9 0,-4; P$10 0,-4.5; P$11 0,-5; P$12 0,-5.5; P$13 0,-6; P$14 0,-6.5; P$15 0,-7; P$16 0,-7.5; P$17 0,-8; P$18 0,-8.5; P$19 0,-9; P$20 0,-9.5; P$21 0,-10; P$22 0,-10.5; P$23 0,-11; P$24 0,-11.5; P$25 0,-12; P$51 15.2,-12; P$52 15.2,-11.5; P$53 15.2,-11; P$54 15.2,-10.5; P$55 15.2,-10; P$56 15.2,-9.5; P$57 15.2,-9; P$58 15.2,-8.5; P$59 15.2,-8; P$60 15.2,-7.5; P$61 15.2,-7; P$62 15.2,-6.5; P$63 15.2,-6; P$64 15.2,-5.5; P$65 15.2,-5; P$66 15.2,-4.5; P$67 15.2,-4; P$68 15.2,-3.5; P$69 15.2,-3; P$70 15.2,-2.5; P$71 15.2,-2; P$72 15.2,-1.5; P$73 15.2,-1; P$74 15.2,-0.5; P$75 15.2,0 | smd 0.3 x 1.6: P$26 1.6,-13.6; P$27 2.1,-13.6; P$28 2.6,-13.6; P$29 3.1,-13.6; P$30 3.6,-13.6; P$31 4.1,-13.6; P$32 4.6,-13.6; P$33 5.1,-13.6; P$34 5.6,-13.6; P$35 6.1,-13.6; P$36 6.6,-13.6; P$37 7.1,-13.6; P$38 7.6,-13.6; P$39 8.1,-13.6; P$40 8.6,-13.6; P$41 9.1,-13.6; P$42 9.6,-13.6; P$43 10.1,-13.6; P$44 10.6,-13.6; P$45 11.1,-13.6; P$46 11.6,-13.6; P$47 12.1,-13.6; P$48 12.6,-13.6; P$49 13.1,-13.6; P$50 13.6,-13.6; P$76 13.6,1.6; P$77 13.1,1.6; P$78 12.6,1.6; P$79 12.1,1.6; P$80 11.6,1.6; P$81 11.1,1.6; P$82 10.6,1.6; P$83 10.1,1.6; P$84 9.6,1.6; P$85 9.1,1.6; P$86 8.6,1.6; P$87 8.1,1.6; P$88 7.6,1.6; P$89 7.1,1.6; P$90 6.6,1.6; P$91 6.1,1.6; P$92 5.6,1.6; P$93 5.1,1.6; P$94 4.6,1.6; P$95 4.1,1.6; P$96 3.6,1.6; P$97 3.1,1.6; P$98 2.6,1.6; P$99 2.1,1.6; P$100 1.6,1.6
ZX62DB5PA8(30) = smd 0.4 x 1.35: +5V -1.3,2.675; D+ -0.65,2.675; D- 0,2.675; GND 1.3,2.675; ID 0.65,2.675 | smd 1.8 x 1.9: GND@1 -1.15,0; GND@2 1.15,0 | drill 0.45 pad 1.9 square: GND@3 -3.65,0; GND@4 3.65,0 | drill 0.85: GND@5 -2.425,3; GND@6 2.425,3
1X01 = drill 1.016 octagon: 1 0,0
TACTILE_SWITCH_PTH_6.0MM = drill 1.016 pad 1.88: 1 -3.251,2.261; 2 3.251,2.261; 3 -3.251,-2.261; 4 3.251,-2.261
0805-NO = smd 1.3 x 1.5: 1 -0.95,0; 2 0.95,0
SMD_0805 = smd 1.092 x 1.397: 1 -0.94,0; 2 0.94,0
MICROBUILDER_SMA_EDGELAUNCH = smd 4.064 x 1.524: GND@1 2.032,-2.54; GND@2 2.032,2.54 | smd 4.064 x 1.524 bottom: GND@3 2.032,2.54; GND@4 2.032,-2.54 | smd 4.064 x 1.27: P 2.032,0
SOT363 = smd 0.5 x 0.5: 1 -0.75,-0.9; 3 0.75,-0.9; 4 0.75,0.9; 6 -0.75,0.9 | smd 0.4 x 0.5: 2 0,-0.9; 5 0,0.9
MICROBUILDER_U.FL = smd 2.2 x 1.05: 1 0,1.375; 2 0,-1.375 | smd 0.8 x 1: 3 1.525,0 | smd 1.05 x 1: P$1 -1.525,0

### Placement (x,y rotation side)
2_5VREG  65,20 270 top
BATTERY  90.37,26.81 270 top
BLUETOOTH  10.98,55.45 0 top
BUZZER  13.54,41.88 0 top
C1  40.75,40.23 135 bottom
C2  34.21,46.51 315 bottom
C3  38.91,48.36 45 bottom
C4  30.52,36.98 90 top
C5  42.96,46.08 135 bottom
C6  38.75,42.29 135 bottom
C7  36.15,44.59 315 bottom
C8  27.2,36.98 90 top
C9  40.47,49.99 45 bottom
C10  44.92,44.05 135 bottom
C11  74.73,22.3 180 top
C12  76.02,17.96 90 top
C13  71.02,25.88 90 top
C14  26.18,47.73 0 top
C15  70.2,34.75 0 bottom
C16  71,66 0 top
C17  75.01,35.61 270 bottom
C18  76.57,65.01 180 top
C19  29.28,23.98 0 bottom
C20  44.36,23.98 0 bottom
C23  84,33 0 top
C24  89.09,36.21 0 top
C27  16.91,64.94 0 bottom
CELLMODEM  69.89,47.19 0 top
CHARGINGIC  75.33,26.61 270 top
CHRG  82.37,12.69 90 top
CPUMP  71.64,18.56 90 top
D1  81.33,59.31 0 bottom
DONE  77.37,12.61 90 top
ENABLE_SWITCH  5.98,15.73 90 top
GPSBIAS  88.87,43.62 180 top
H1  91.37,2.68 0 top
H2  2.67,67.46 0 top
H3  2.83,2.67 0 top
H4  91.31,67.4 0 top
HEARTBEAT  26.8,42.17 90 top
J1  70.35,47.59 0 bottom
JTAG  37.28,62.36 0 top
L2  87.54,60.68 180 top
LCD  35.83,15.77 0 top
MICROC  40.82,35.12 135 top
MICROUSB  91.35,15.21 90 top
MOSI_TEST  11,27 0 top
NETSTATLED  88.82,55.04 90 top
PB1  12.68,20.75 0 top
PB2  12.63,13.49 0 top
PB3  12.7,6.19 0 top
POWERLED  71.8,13.18 90 top
PWRSTATLED  89.9,51.15 90 top
R1  79.86,22.17 90 top
R2  79.8,26.11 270 top
R3  82.86,17.47 90 top
R4  28.85,53.31 0 bottom
R5  56.04,64.36 180 top
R6  51.86,58.77 90 top
R7  12.7,20.96 90 bottom
R8  13,14 90 bottom
R9  13,6 90 bottom
R10  3.8,20.9 180 bottom
R11  65,15 0 top
R12  90,57 0 top
R13  90,53 0 top
R14  26.85,44.27 0 top
SCLK_TEST  15,27 0 top
SMA_ANT  56.99,69.56 270 top
SMF05C  64.04,37.07 270 bottom
SW1  29,54 0 top
UFL  89.9,47.74 270 top

### Tracks (layer width: path | path; a pad name or v marks a point on that pad's centre or on a via)
1.8V  (via drill 0.35)
  Top 0.406: CELLMODEM.20 55.03,37.55 56.5,37.55 56.5,37.5 59,35 66,35 66.43,35.43 v66.43,37.55 72.59,43.72 v79.69,43.72
  Bottom 0.406: SMF05C.1 66.16,37.82 v66.43,37.55 | v79.69,43.72 82,43.72 J1.C1
+5V  (via drill 0.6)
  Top 0.406: MICROUSB.+5V 85.96,13.94 84.71,12.69 CHRG.A
  Top 0.61: CHRG.A 83.42,13.58 v83,14 | v80.25,13.92 79.86,14.31 v79.86,15.8 | v77.19,24.04 77.19,25.1 | 77.19,25.1 CHARGINGIC.4 | 77.19,25.1 75.8,23.71 75.12,23.71 73.71,22.3 C11.2
  Bottom 0.61: v83,14 80.33,14 v80.25,13.92 | v79.86,15.8 77.19,18.47 v77.19,24.04
BLUEUART1  (via drill 0.35)
  Top 0.254: BLUETOOTH.P05 11.27,61.59 9.79,61.59 9.06,62.31 v9.06,62.5 | JTAG.10 38.63,62.44 38.63,59.01 41.02,56.62 43.79,59.39 43.79,61.53 44.49,62.23 52.33,62.23 53.15,61.41 53.15,58.09 v53.17,58.07 | MICROC.P$50 42.47,56.01 52.77,56.01 v53.17,56.41
  Bottom 0.254: JTAG.10 38.64,64.8 28,64.8 | 28,64.8 27.93,64.8 | v53.17,56.41 v53.17,56.42 v53.17,58.07 | 28,64.8 26.01,66.57 13,66.4 | 13,66.4 12.79,66.4 | 13,66.4 9.88,66.42 9.06,65.48 v9.06,62.5
BLUEUART2  (via drill 0.35)
  Top 0.254: v36.69,57.33 36.74,56.17 MICROC.P$51 | JTAG.12 42.36,65.64 40,68 v24,68 | 11.15,60.27 BLUETOOTH.P06 11.2,60.38 8.57,60.38 8,60.95 8,67 v9,68
  Bottom 0.254: v36.69,57.33 39.33,60 40.33,60 40.94,60.61 40.94,62.07 42.36,63.49 JTAG.12 | v24,68 v9,68
BLUEWAKEHW  (via drill 0.35)
  Top 0.254: BLUETOOTH.P15 20.45,54.98 22.56,54.98 28.64,61.06 28.64,61.66 29.15,62.16 32.66,62.16 33.29,61.53 33.29,59.92 33.65,59.56 36.24,59.56 39.8,56 v40,56 | v42.72,55.09 42.72,54.86 42.51,54.65 42.12,54.65 41.82,54.65 MICROC.P$49
  Bottom 0.254: v42.72,55.09 42.72,55.63 42.35,56 v40,56
BLUEWAKESW  (via drill 0.35)
  Top 0.254: 40.05,53.05 v40,53 40.58,53 40.88,53 MICROC.P$48 | BLUETOOTH.P07 9.15,59.15 v8,58
  Bottom 0.254: v40,53 34.89,53 34.4,52.51 33.55,52.51 26.9,59.16 20.06,59.16 16.91,56 9,56 8,57 v8,58
CELLRESET
  Top 0.254: MICROC.P$42 45.82,53.69 CELLMODEM.4
CELLUART1  (via drill 0.35)
  Top 0.254: MICROC.P$41 45.8,52.97 v46.14,53.01 | JTAG.14 45.63,64.36 R5.2
  Bottom 0.254: v46.14,53.01 46.12,53.03 46,62.52 JTAG.14
CELLUART2
  Top 0.254: R6.2 51.86,60.14 51,61 44.98,61 JTAG.13 44.9,59.11 39.82,54.03 39.82,53.96 39.11,53.25 39.11,52.39 39.42,52.08 40.11,52.08 42.01,50.17 43.68,50.17 44.33,50.82 MICROC.P$40 | 43.76,50.22 MICROC.P$40 | 44.36,50.79 MICROC.P$40
CONNECTIONSTAT  (via drill 0.35)
  Top 0.254: 20,49.09 v20,49 18.79,49 13.73,54.05 BLUETOOTH.P10 | MICROC.P$47 41.88,53.27 41.23,52.62 41.23,52.02 v41.63,51.63 | v39,46.16 40.77,47.92 v40.77,50.23
  Bottom 0.254: 20.02,48.98 v20,49 34.54,49 34.58,49.03 35.29,49.03 38.18,46.14 38.98,46.14 v39,46.16 | v40.77,50.23 41.63,51.09 v41.63,51.63
CS  (via drill 0.35)
  Top 0.254: LCD.18 32.02,33 v33,33 | v41.91,34.04 42.4,34.53 42.4,34.92 41.53,35.8 MICROC.P$3
  Bottom 0.254: v33,33 39.03,33 39.56,32.47 40.31,32.47 v41.91,34.04
DM  (via drill 0.35)
  Top 0.254: v52.45,44.88 52.57,44.88 53.39,45.69 CELLMODEM.12 | MICROUSB.D- 87,15.23 86.01,15.23 v86,15.24
  Bottom 0.254: v52.45,44.88 52.45,38.96 52.44,38.95 52.44,36.77 68.19,21.01 68.19,15.52 69.68,14.03 72.65,14.03 73.5,14.88 84,14.88 84.37,15.24 v86,15.24
DP  (via drill 0.35)
  Top 0.254: v52.26,35.15 52.26,43.07 53.88,44.69 CELLMODEM.13 | v84.97,14.03 85.5,14.56 87.95,14.56 MICROUSB.D+
  Bottom 0.254: v52.26,35.15 52.26,19.74 61,11 83,11 85,13 85,14 v84.97,14.03
ENABLEPB  (via drill 0.35)
  Top 0.254: 5.98,16.04 ENABLE_SWITCH.2 4.63,15.73 2,18.37 2,29 v5,32 | v32.09,37.29 33.65,37.29 MICROC.P$90
  Bottom 0.254: v5,32 13,40 29.37,40 v32.09,37.29
GND  (via drill 0.35)  (1 unrouted)
  Top 0.254: v37.5,38.47 38.77,37.2 38.77,36.74 MICROC.P$98 | v47.78,44.31 49.3,45.83 MICROC.P$26 | v33.94,42.4 33.5,41.96 33.39,41.96 MICROC.P$83 31.63,40.21 31.63,39.85 | v37.68,51.05 37.62,51.05 MICROC.P$57 35.42,53.25 35.39,53.25 | UFL.1 91.24,49.01 90.22,49.31 88.93,49.3 88.36,48.68 | MICROC.P$86 32.54,39 32,39 | MICROC.P$80 30.7,41.41 30.58,41.41
  Top 0.61: CELLMODEM.40 79.39,33.3 v78.5,34.18 82.01,37.68 84.88,37.68 CELLMODEM.41 | 2_5VREG.2 63.19,19.05 62.54,18.4 62.54,16.51 R11.1
  Top 0.813: C11.1 76.13,19.47 C12.2
  Bottom 0.254: C1.2 41.74,41.28 C6.2 37.23,43.28 35.72,41.77 35.72,40.24 v37.5,38.47 | C7.2 33.96,42.4 v33.94,42.4 | C3.2 39.37,50.92 | 39.37,50.92 39.42,50.98 C9.2 | C5.2 43.95,47 C10.2 46.64,44.31 v47.78,44.31 | SMF05C.2 65.62,37.07 v65.66,37.03 | v37.68,51.05 39.23,51.05 39.37,50.92
  Bottom 0.61: 74.39,34.82 C17.2 78.47,34.21 v78.5,34.18
  Bottom 0.813: JTAG.9 39.47,60.74 39.2,60.74 39.19,60.74 39.08,60.74
  pour Top (isolate 0.305): 1,69 61,69 61,1 1,1
  pour Top (isolate 0.305): 61,69 93,69 93,23 61,23
  pour Top (isolate 0.305): 93,1 93,19 61,19 61,1
  pour Bottom (isolate 0.305): 1,69 93,69 93,1 1,1
GSM_ANT  (via drill 0.35)
  Top 0.254: CELLMODEM.59 59.31,55.69 56.06,58.94 56.06,61.06 v58,63 | v58.19,65.03 58.19,65.56 56.99,66.76 SMA_ANT.P
  Bottom 0.254: v58,63 58.19,63.19 v58.19,65.03
HEART
  Top 0.254: MICROC.P$82 31.42,40.72 29.44,40.72 27.99,42.17 HEARTBEAT.A
LCDRESET  (via drill 0.35)
  Top 0.254: v43,34 44,35 44,36.18 MICROC.P$7 | v38.51,28.37 37.37,27.22 v37.27,27.22 | LCD.20 24.4,26.6 24.89,26.11 v36.07,26.11
  Bottom 0.254: v43,34 41,32 41,28.64 40.65,28.29 38.59,28.29 v38.51,28.37 | v37.27,27.22 36.05,26 v36.07,26.11
MISO  (via drill 0.35)
  Top 0.254: MICROC.P$5 43.09,35.68 v43.09,35.05
  Bottom 0.254: v43.09,35.05 43.09,34.88 43.68,34.28 43.68,33.72 43.28,33.31 43.28,29.18 41.7,27.59 38.09,27.59 37.49,28.19 37.49,30.08 LCD.15
MOSI  (via drill 0.35)
  Top 0.254: v41.68,38.2 41,37.52 41,37 41.06,37 MICROC.P$4 | v22,22 17.62,22 16.52,20.9 13.08,20.9 13.02,20.84 11,22.86 MOSI_TEST.1 | v49,27 48,26 v45,26
  Bottom 0.254: 40.27,24.34 39.73,24.34 38.1,25.96 36.9,25.96 36.27,25.34 35.73,25.34 35.34,25.73 35.34,29.69 LCD.16 | 40.27,24.34 41.47,25.54 44.53,25.54 v45,26 | 40.27,24.34 37.93,22 v22,22 | v41.68,38.2 42.5,38.2 49,31.7 v49,27
N$1
  Top 0.406: CHRG.C 81.32,19.76 R1.1
N$2  (via drill 0.35)
  Top 0.406: R1.2 79.86,25.1 R2.2 80.92,25.16 81.82,26.06 81.82,27.7 v81.1,28.42 | v75.39,27.56 v75.38,27.56 CHARGINGIC.1
  Bottom 0.406: v81.1,28.42 77.25,28.42 76.39,27.56 v75.39,27.56
N$3
  Bottom 0.254: C20.1 47.26,25.48 LCD.11
N$4
  Top 0.406: 73.39,18.21 73.38,18.22 | CPUMP.2 73.3,18.3 73.38,18.22 | 73.38,18.22 73.38,16.35 72.79,15.76 70.04,15.76 2_5VREG.4
N$5  (via drill 0.35)
  Top 0.406: CHARGINGIC.5 77.82,27.56 v77.84,27.54 | v84.45,17.94 84.45,17.16 83.81,16.52 R3.1
  Bottom 0.406: v77.84,27.54 84.45,20.93 v84.45,17.94
N$6
  Top 0.406: DONE.A 78.42,24 78.42,24.43 78.42,26.42 79.06,27.06 R2.1
N$7
  Top 0.406: 2_5VREG.6 69.86,20 69.88,20.02 70.23,19.66 70.23,17.57 70.65,17.16 CPUMP.1
N$8  (via drill 0.35)
  Top 0.254: CELLMODEM.79 61.39,60.54 61.95,59.97 61.98,60 v62,60 | v74.12,42.41 78.66,37.87 v78.66,37.15 | v84.54,35.63 85.13,36.21 C24.1
  Bottom 0.254: v62,60 74.12,47.88 v74.12,42.41 | v78.66,37.15 80.09,34.52 83.44,34.52 v84.54,35.63
N$9
  Top 0.254: GPSBIAS.1 89.88,43.73 | UFL.3 89.9,46.1 91,45 91,44 90.38,43.38 90.13,43.38 GPSBIAS.1 | C24.2 90.48,39.37 90.05,39.81 90.05,43.46 GPSBIAS.1
N$10  (via drill 0.35)
  Top 0.254: R5.1 57,64.35 60.28,64.35 v60.34,64.41 | 69.44,61.44 69.48,61.44 69.48,62.1 CELLMODEM.71 69.39,63.77 68.8,64.35 63.31,64.35 v63.27,64.39
  Bottom 0.254: v63.27,64.39 60.36,64.39 v60.34,64.41
N$11  (via drill 0.35)
  Top 0.254: CELLMODEM.68 72.39,59.39 71,58 v58.22,57.97 | v54.08,57.57 53.71,57.19 52.88,57.19 52.25,57.82 R6.1
  Bottom 0.254: v58.22,57.97 57.35,57.97 56.95,57.57 v54.08,57.57
N$12
  Top 0.813: POWERLED.C 67.77,13.18 R11.2
N$13
  Top 0.254: 87.77,55.23 NETSTATLED.C 89.05,56.32 R12.1
N$14
  Bottom 0.61: R10.1 2.85,19.48 1.83,18.46 1.83,14.85 ENABLE_SWITCH.1
N$15
  Top 0.254: R13.1 88.85,52.8 PWRSTATLED.C
N$16  (via drill 0.4)
  other vias: 2,64
N$17  (via drill 0.4)
  other vias: 3.56,64.16
N$18  (via drill 0.4)
  other vias: 5.1,64.69
N$19  (via drill 0.4)
  other vias: 5.93,66.13
N$20  (via drill 0.4)
  other vias: 6.25,67.74
N$21  (via drill 0.4)
  other vias: 0.7,63.98
N$22  (via drill 0.4)
  other vias: 6.29,69.07
N$23  (via drill 0.4)
  other vias: 1.92,62.67
N$24  (via drill 0.4)
  other vias: 4.44,63.19
N$25  (via drill 0.4)
  other vias: 3.31,62.77
N$26  (via drill 0.4)
  other vias: 7.94,48.34
N$27  (via drill 0.4)
  other vias: 5.53,42.35
N$28  (via drill 0.4)
  other vias: 4.19,49.5
N$29  (via drill 0.4)
  other vias: 6.33,46.73
N$30  (via drill 0.4)
  other vias: 4.01,48.07
N$31  (via drill 0.35)
  Top 0.254: v87,42 87.69,42 87.85,42.16 GPSBIAS.2 | v90,60 89.32,60.68 L2.1
  Bottom 0.254: v87,42 86,43 86,56 88,58 89,58 90,59 v90,60
N$32  (via drill 0.4)
  other vias: 5.97,48.43
N$33  (via drill 0.4)
  other vias: 4.64,45.84
N$34  (via drill 0.4)
  other vias: 2.14,5.14
N$35  (via drill 0.4)
  other vias: 3.66,5.07
N$36  (via drill 0.4)
  other vias: 5.04,3.9
N$37  (via drill 0.4)
  other vias: 5.45,2.42
N$38  (via drill 0.4)
  other vias: 5.69,1.05
N$39  (via drill 0.4)
  other vias: 0.64,5.14
N$40  (via drill 0.4)
  other vias: 1.2,6.1
N$41  (via drill 0.4)
  other vias: 3,5.97
N$42  (via drill 0.4)
  other vias: 4.91,5
N$43  (via drill 0.4)
  other vias: 6.05,3.42
N$44  (via drill 0.4)
  other vias: 6.71,1.64
N$45  (via drill 0.4)
  other vias: 7.33,0.68
N$46  (via drill 0.4)
  other vias: 92.65,5.33
N$47  (via drill 0.4)
  other vias: 90.5,5.33
N$48  (via drill 0.4)
  other vias: 89.08,4.13
N$49  (via drill 0.4)
  other vias: 88.7,2.8
N$50  (via drill 0.4)
  other vias: 88.74,0.82
N$51  (via drill 0.4)
  other vias: 87.58,2.11
N$52  (via drill 0.4)
  other vias: 87.58,3.79
N$53  (via drill 0.4)
  other vias: 88.82,5.12
N$54  (via drill 0.4)
  other vias: 91.75,6.24
N$55  (via drill 0.4)
  other vias: 89.86,6.37
N$56  (via drill 0.4)
  other vias: 87.23,0.99
N$57  (via drill 0.4)
  other vias: 93.21,6.24
N$58  (via drill 0.4)
  other vias: 89.39,69.34
N$59  (via drill 0.4)
  other vias: 89.02,68.12
N$60  (via drill 0.4)
  other vias: 89.04,66.7
N$61  (via drill 0.4)
  other vias: 89.74,65.64
N$62  (via drill 0.4)
  other vias: 90.66,64.89
N$63  (via drill 0.4)
  other vias: 92.38,65.14
N$64  (via drill 0.4)
  other vias: 93.3,65.81
N$65  (via drill 0.4)
  other vias: 93.2,64.27
N$66  (via drill 0.4)
  other vias: 91.46,64.17
N$67  (via drill 0.4)
  other vias: 89.59,64.66
N$68  (via drill 0.4)
  other vias: 88.6,65.66
N$69  (via drill 0.4)
  other vias: 88.05,67.2
N$70  (via drill 0.4)
  other vias: 88.05,68.67
N$71  (via drill 0.4)
  other vias: 76,59
N$72  (via drill 0.4)
  other vias: 75,59
N$73  (via drill 0.4)
  other vias: 75,58
N$74  (via drill 0.4)
  other vias: 76,58
N$75  (via drill 0.4)
  other vias: 64,49
N$76  (via drill 0.4)
  other vias: 65,49
N$77  (via drill 0.4)
  other vias: 64,48
N$78  (via drill 0.4)
  other vias: 65,48
N$79  (via drill 0.4)
  other vias: 28,17
N$80  (via drill 0.4)
  other vias: 29,16
N$81  (via drill 0.4)
  other vias: 30,15
N$82  (via drill 0.4)
  other vias: 30,17
N$83  (via drill 0.4)
  other vias: 28,15
N$84
  Top 0.254: HEARTBEAT.C 25.75,42.33 24.72,43.36 24.73,43.37 24.73,44.18 25.21,44.66 25.5,44.66 R14.1
N$86  (via drill 0.4)
  other vias: 67,10
N$87  (via drill 0.4)
  other vias: 69,10
N$88  (via drill 0.4)
  other vias: 71,10
N$89  (via drill 0.4)
  other vias: 73,10
N$90  (via drill 0.4)
  other vias: 75,10
N$91  (via drill 0.4)
  other vias: 77,10
N$92  (via drill 0.4)
  other vias: 79,10
N$93  (via drill 0.4)
  other vias: 81,10
N$94  (via drill 0.4)
  other vias: 65,10
N$95  (via drill 0.4)
  other vias: 63,10
NETSTAT
  Top 0.254: NETSTATLED.A 88.91,54.08 88.26,54.08 86.59,52.41 86.53,52.35 86.19,52.01 86.19,48.14 85.74,47.69 CELLMODEM.51 85.62,47.69 85.64,47.67
PB1  (via drill 0.35)
  Top 0.254: MICROC.P$92 32.77,35.08 v32.73,35.08
  Bottom 0.254: PB1.1 10.53,21.91 R7.2 12.7,26.25 21.45,35 32.65,35 v32.73,35.08
PB2  (via drill 0.35)
  Top 0.254: MICROC.P$93 34.11,35.62 v34.11,35.42
  Bottom 0.254: PB2.1 10.18,14.95 12.93,14.95 | 12.93,14.95 R8.2 | 12.93,14.95 12.93,15.94 14.06,17.07 17.6,17.07 18.01,17.48 18.01,30.52 21.45,33.96 21.67,34.18 21.9,34.41 32.43,34.41 32.45,34.39 33.08,34.39 v34.11,35.42
PB3  (via drill 0.35)
  Top 0.254: 36.11,36.89 36.44,37.22 MICROC.P$94 36.44,37.21 35.79,36.56 35.79,35.51 v34.93,34.66
  Bottom 0.254: PB3.1 10.95,6.95 12.93,6.95 | 12.93,6.95 R9.2 | v34.93,34.66 34.06,34.66 33.34,33.94 32.26,33.94 32.25,33.94 22.3,33.94 18.86,30.51 18.86,8.88 16.64,6.66 13.22,6.66 12.93,6.95
PWM  (via drill 0.35)
  Top 0.254: MICROC.P$11 41.93,41.08 v34.78,41.08
  Bottom 0.254: v34.78,41.08 19.34,41.08 BUZZER.P$1
PWRKEY
  Top 0.254: MICROC.P$43 46.11,54.69 CELLMODEM.3
PWRSTAT
  Top 0.254: PWRSTATLED.A 89.91,50.12 89.27,50.12 87.69,50.12 86.81,49.24 86.81,46.09 86.45,45.73 84.92,45.73 CELLMODEM.49
RST  (via drill 0.35, 0.8)
  Top 0.254: v52,52 50,48.68 MICROC.P$29 | v31,54 v34,54
  Top 0.813: v29,51 28,50 26,50 24.78,48.78 C14.1
  Bottom 0.254: v52,52 48.68,52.32 45.75,52.32 45.37,52.7 45.37,58.08 JTAG.11 36.41,55.14 36.02,55.14 34.88,54 v34,54 | R4.1 30.31,53.31 v31,54
  Bottom 0.813: v29,51 29.79,51.79 R4.1 29.79,54.21 27.74,56.26 SW1.1
SCLK  (via drill 0.35)
  Top 0.254: v40.32,36.6 40.32,36.33 MICROC.P$2 | 35.7,24 18,24 SCLK_TEST.1 | LCD.17 32.02,28.29 v33.44,26.94 | v34.68,25.02 35.7,24 | 35.7,24 36.25,23.44 37.44,23.44 v40,26
  Bottom 0.254: 40,26.05 v40,26 41.09,27.09 45.52,27.09 46,27.58 46,33.21 42.09,37.13 40.95,37.13 40.32,36.69 v40.32,36.6 | v33.44,26.94 34.68,25.63 v34.68,25.02
SIMCLK  (via drill 0.35)
  Top 0.254: v59.1,36.68 57.1,38.68 CELLMODEM.19
  Bottom 0.254: v59.1,36.68 59.46,36.32 SMF05C.4 63.59,36.32 64.04,36.77 64.04,38.46 64.54,38.96 72.72,38.96 82.62,48.86 J1.C3
SIMDATA  (via drill 0.35)
  Top 0.254: v59.1,37.68 56.09,40.69 CELLMODEM.17
  Bottom 0.254: SMF05C.5 59.71,37.07 v59.1,37.68 59.1,47.5 J1.C7
SIMRST  (via drill 0.35)
  Top 0.254: v53.23,38.68 54.11,39.69 CELLMODEM.18
  Bottom 0.254: 72.74,38.26 72.43,37.95 69,37.95 67.38,36.32 SMF05C.3 64.3,35.68 54.52,35.74 53.12,37.04 v53.23,38.68 | 72.74,38.26 | 72.74,38.26 79.74,45.26 | 79.74,45.26 | 79.74,45.26 80.74,46.26 | 80.74,46.26 80.77,46.28 | 80.74,46.26 82.9,46.26 J1.C2
TCK  (via drill 0.35)
  Top 0.254: MICROC.P$33 49.34,50.85 49.34,51.27 51,52.93 v51,53
  Bottom 0.254: JTAG.7 38.38,61.09 39.4,62.1 40.24,62.1 | v51,53 52.07,54.07 55.84,54.07 59.36,57.59 59.36,58.44 53.09,64.7 41.85,64.7 41.37,64.22 41.03,63.76 41.04,62.99 40.24,62.1 | 40.24,62.1 40.25,62.09
TDI  (via drill 0.35)
  Top 0.254: v38.72,55.38 37.4,56.71 37.4,57.7 36.1,59 33,59 32.2,59.8 JTAG.3 | v42.73,47.96 44.69,46 45.87,46 47.51,47.64 MICROC.P$31
  Bottom 0.254: 49.51,49.51 52.02,47 51.69,44.72 49.98,43.02 45.99,43.02 42.15,46.86 42.15,47.38 v42.73,47.96 | 49.51,49.51 48.71,50.31 | 49.51,49.51 49.49,49.51 48,51 44.27,51 40.29,54.98 39.13,54.98 v38.72,55.38
TDO  (via drill 0.35)
  Top 0.254: JTAG.1 36.29,54.45 v36.31,54.45 | MICROC.P$30 49,48.39 v49.13,48.84
  Bottom 0.254: v36.31,54.45 39.8,54.45 44.27,49.99 48.01,49.99 48.31,49.69 v49.13,48.84
TEST  (via drill 0.35)
  Top 0.254: MICROC.P$28 v51,49 | v41,58 41,64 40,65 38,65 JTAG.8
  Bottom 0.254: v41,58 44.56,54.44 44.56,52.73 45.63,51.66 48.34,51.66 v51,49
TMS  (via drill 0.35)
  Top 0.254: v36,66 35.77,66 35,66 34.76,66 33.42,64.66 33.42,62.41 33.75,62.08 33.91,61.91 JTAG.5 | MICROC.P$32 50.04,50.84 v50.16,50.84
  Bottom 0.254: v36,66 36.64,65.36 53.15,65.36 60.06,58.44 60.06,57.56 53.35,50.84 v50.16,50.84
VBAT  (via drill 0.45, 0.65, 0.8)
  Top 0.406: 2_5VREG.5 67.75,19 67.93,19 v69.08,19
  Top 0.61: v70,22 71.02,23.02 C13.1 72.85,24.48 CHARGINGIC.3 | 2_5VREG.3 66.01,18.1 66.91,19 67.93,19 | POWERLED.A 72.85,14.21 v72.31,14.8
  Top 0.813: 78.39,30 78.39,29.76 82,29.76 | 78.39,32 CELLMODEM.39 78,32.19 | 78,32.19 CELLMODEM.38 77.39,31 78,31 78,32 78.39,32 | 78.39,32 77.51,32.87 v77.34,35.4 | 78.39,30 77.39,29 v76,29 | C18.1 78.39,64.6 78.39,63 | 78.39,63 CELLMODEM.62 | C18.1 77.77,64.05 | 77.77,64.05 CELLMODEM.63 | 77.47,63 77.39,63 CELLMODEM.63 | CELLMODEM.62 78.39,61.62 77.47,61.62 77.47,62.19 | 77.47,62.19 CELLMODEM.63 | 78.39,63 77.47,63 | 77.47,63 77.47,62.19 | CELLMODEM.63 CELLMODEM.62 | L2.2 86.32,60.68 v85,62 85,62.3 82.29,65.02 C18.1 | BATTERY.2 84.19,25.81 83,27 83,29 82.24,29.76 82,29.76 | 82,29.76 82.6,30.36 C23.1 | 78.39,30 78,30.39 78,32.19 | C16.1 71.6,68 76,68 78,66 78,64.28 77.77,64.05
  Bottom 0.61: 74.72,36.72 C17.1 | v70,22 70,20.15 v69.08,19 69.08,16.08 69.96,15.19 71.87,15.19 v72.31,14.8
  Bottom 0.813: v77.34,35.4 75.98,36.04 C17.1 73.86,37.01 C15.1 | v76,29 73,29 70,26 v70,22 | 85,58 85,41 83.64,39.63 77.63,39.63 74.72,36.72 | 85,58 83.69,59.31 D1.C | 85,58 v85,62
VCC  (via drill 0.35, 0.8)
  Top 0.254: 38.2,35.49 MICROC.P$99 39.9,37.17 v39.9,37.52 | v36.1,49.77 37,50.66 37,50.96 MICROC.P$58 | 49.63,46.9 | 49.63,46.9 MICROC.P$27 49.88,47.15 50.57,47.15 51.12,46.6 51.12,44.58 51,44.47 | MICROC.P$79 31.13,42.57 32.08,43.52 32.08,43.88 31.75,44.21 v31.22,44.72 30.09,45.87 MICROC.P$75 29.55,46.4 25.02,46.4 23,44.37
  Top 0.813: C12.1 76.02,15.02 v74.8,13.84 | v60,17 60,18 | 60,18 62,20 63,20 | 63,20 64,20 | 64,20 2_5VREG.1 | 47,28 50,28 57.5,20.5 63.5,20.5 | 47,28 44.85,30.15 | 47,28 44,28 | 44,28 42.18,29.82 LCD.13 LCD.12 | 51,32 50.5,32.5 | 51,32 51,33 | 63,20 51,32 | 60,18 53.96,11.96 24,11.96 | 44,28 40,28 v37.16,24.8 | 64,20 63.5,20.5 | 63.5,20.5 51,33 | v48,38 50.5,35.5 | 50.5,35.5 50.76,35.24 | 50.5,35.5 50.5,32.5 | 24,11.96 16.96,11.96 16,11 9.61,11 PB2.3 | 24,11.96 17.96,18 9.92,18 PB1.3 | 24,11.96 16.04,4 9.53,4 PB3.3 | v39.94,33.65 40.59,33 | 50.5,32.5 50,33 40.59,33 | 40.59,33 35,33 34,34 32,34 30.52,35.48 C4.1 C8.1 26.42,35.58 23,39 23,44.37 23,49 22,50 22,53 v22.22,53.22 | v50.48,44.99 51,44.47 51,33 | v24,58 27.6,62.05 JTAG.2 29.66,64.34 29,65 v24.46,65.1 BLUETOOTH.P23
  Bottom 0.254: v39.9,37.52 40.04,38.97 40,39 C1.1 39.76,39.3 C6.1 | C7.1 37.11,45.58 C2.1 32.5,47.5 31,46 31,44.96 v31.22,44.72 | C9.1 41.41,49.01 C3.1 37.61,47.37 36.1,48.88 v36.1,49.77 | C10.1 43.93,43.13 43.53,43.53 C5.1 | C19.1 30.7,24
  Bottom 0.813: v74.8,13.84 73,12 62,12 60,14 v60,17 | v39.94,33.65 38,35 38,36 40,38 40,39 | v48,38 43.53,42.47 43.53,43.53 | v50.48,44.99 46.99,49.01 C9.1 | v37.16,24.8 35.98,23.98 C19.1 | R10.2 7.02,20.9 PB1.3 | v24,58 22.25,56.21 22.24,55 v22.22,53.22 23,54 27.23,54 R4.2 | v24.46,65.1 C27.1
  pour Top (isolate 0.406): 66,20 66,19.72 62.08,19.72 62.08,21.81 66,21.81 66,20
WAKEUPHOST  (via drill 0.35)
  Top 0.254: CELLMODEM.69 71.39,59.39 71,59 v57.38,59 | v47.13,53.01 47,52.76 MICROC.P$39
  Bottom 0.254: v57.38,59 53,59 v47.13,53.01
(copper drawn outside any net)
  shapes: Top area x2

### Text on the board
tPlace: BLUETOOTH | Authors: Yunsheng Li, Nick Geirland, Nathan McNally, Aaron Kaiser | ECE 477 Group 16 | Track-on-Track | Date: 3/10/2018